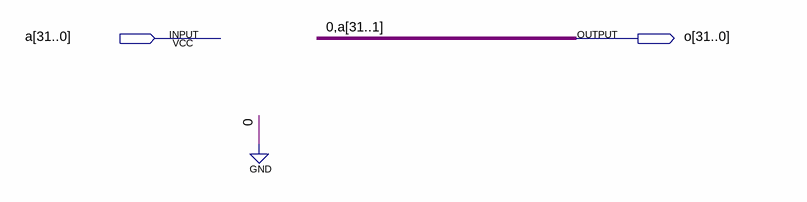
[diagram p0: schematic sheet]
// Quartus schematic LOG_SR32.bdf as structural Verilog: 0 symbols, 2 pins
module LOG_SR32 (
  input  [31:0] a,
  output [31:0] o
);


  assign o = {1'b0, a[31:1]};
endmodule
